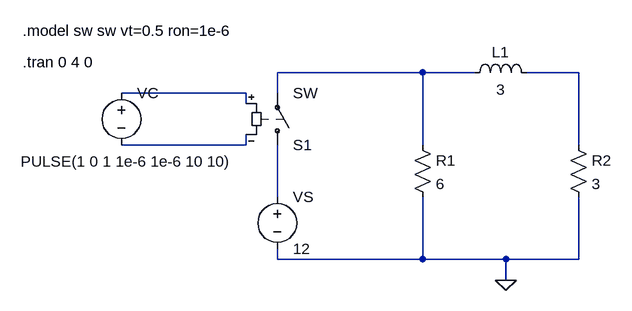
[diagram p0: schematic exercise1_assignment4.asc]
exercise1_assignment4.asc, the LTspice schematic file:
Version 4
SHEET 1 880 680
WIRE 496 96 272 96
WIRE 576 96 496 96
WIRE 736 96 656 96
WIRE 224 128 32 128
WIRE 272 128 272 96
WIRE 224 144 224 128
WIRE 224 208 224 192
WIRE 224 208 32 208
WIRE 496 208 496 96
WIRE 736 208 736 96
WIRE 272 288 272 208
WIRE 272 384 272 368
WIRE 496 384 496 288
WIRE 496 384 272 384
WIRE 624 384 496 384
WIRE 736 384 736 288
WIRE 736 384 624 384
WIRE 624 416 624 384
FLAG 624 416 0
SYMBOL voltage 32 112 R0
WINDOW 3 -155 121 Left 2
WINDOW 123 0 0 Left 0
WINDOW 39 0 0 Left 0
SYMATTR InstName VC
SYMATTR Value PULSE(1 0 1 1e-6 1e-6 10 10)
SYMBOL sw 272 224 M180
SYMATTR InstName S1
SYMBOL voltage 272 272 R0
WINDOW 123 0 0 Left 0
WINDOW 39 0 0 Left 0
SYMATTR InstName VS
SYMATTR Value 12
SYMBOL res 480 192 R0
SYMATTR InstName R1
SYMATTR Value 6
SYMBOL res 720 192 R0
SYMATTR InstName R2
SYMATTR Value 3
SYMBOL ind 560 112 R270
WINDOW 0 32 56 VTop 2
WINDOW 3 5 56 VBottom 2
SYMATTR InstName L1
SYMATTR Value 3
TEXT -120 32 Left 2 !.model sw sw vt=0.5 ron=1e-6
TEXT -120 80 Left 2 !.tran 0 4 0

The netlist it stands for:
* exercise1_assignment4.asc
VC N003 N004 PULSE(1 0 1 1e-6 1e-6 10 10)
S1 N005 N001 N003 N004 SW
VS N005 0 12
R1 N001 0 6
R2 N002 0 3
L1 N001 N002 3
.model sw sw vt=0.5 ron=1e-6
.tran 0 4 0
.backanno
.end